# Altium schematic sheet LCD-Connecteur.SchDoc: LCD - Connecteurs
size Letter; ApprovedBy: APPROUVÉ PAR; Organization: Cegep Limoilou; Address1: 1300, 8e Avenue; Address2: Québec, QC; Address3: Canada; Address4: G1J 5L5; SheetNumber: 5; SheetTotal: 7
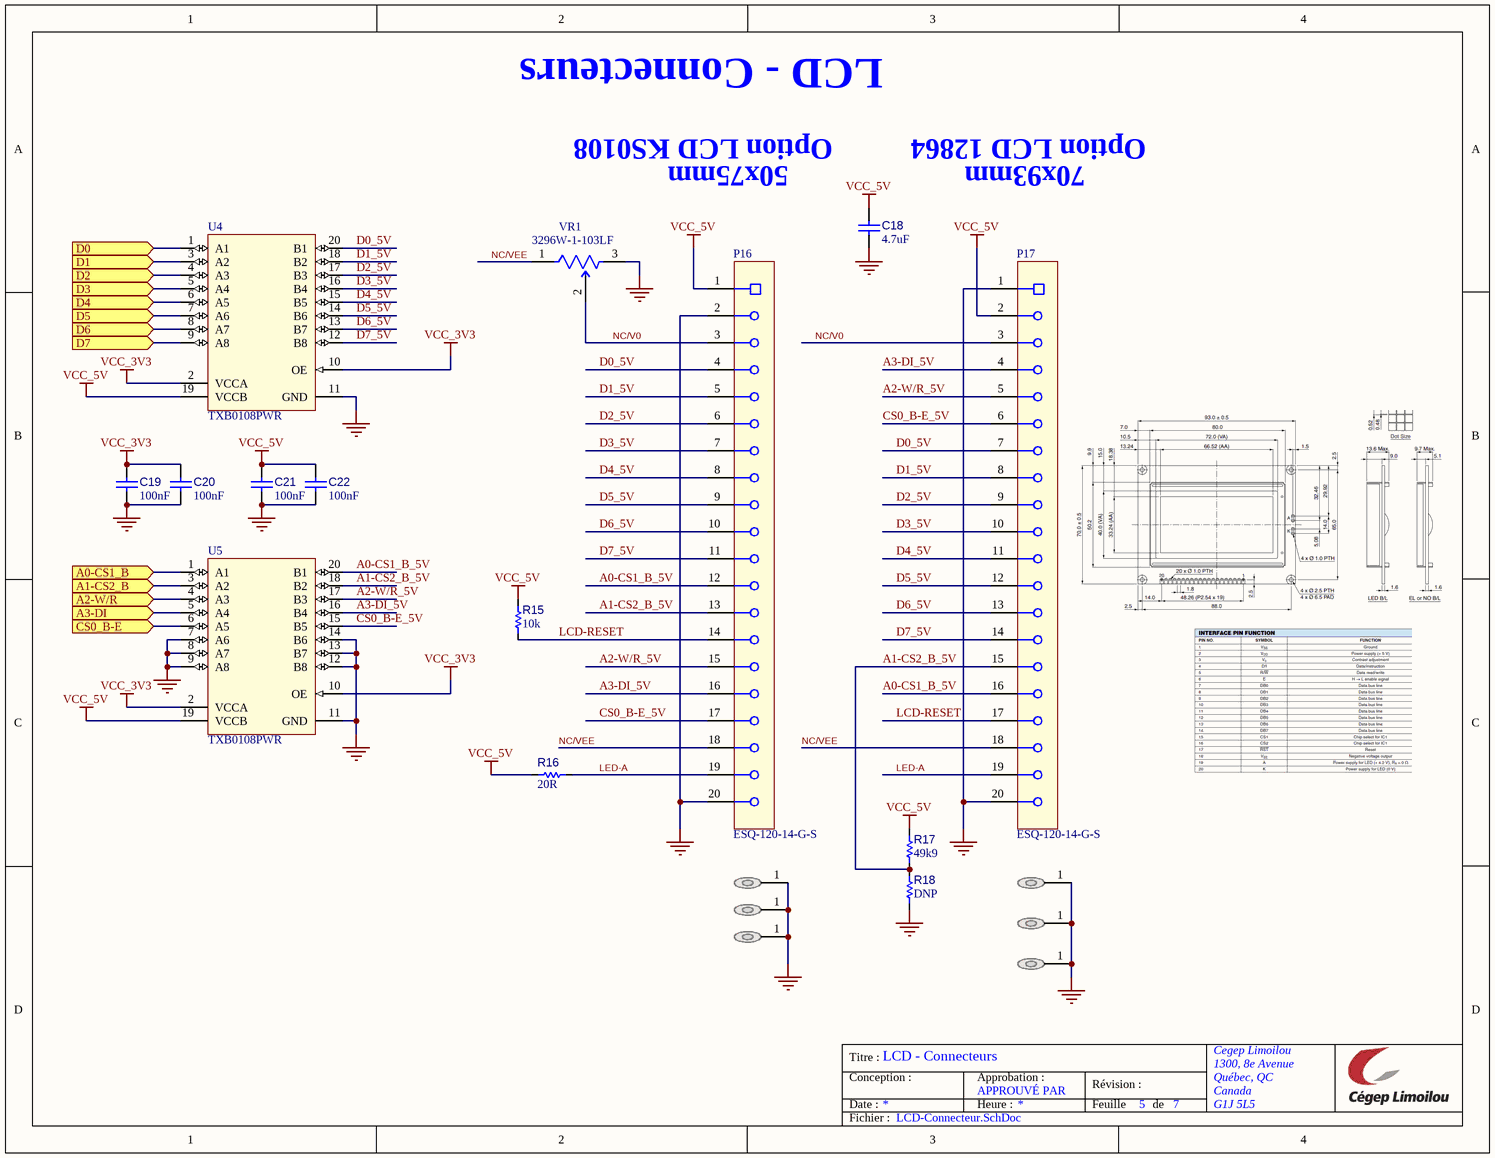
[diagram p0: LCD-Connecteur.SchDoc]

## Parts
C18  value 4.7uF  [C_2012[0805]]  (hidden comment: Cap 4.7uF 0805)
C19  value 100nF  [C_1005[0402]]  (hidden comment: Cap 100nF 0402)
C20  value 100nF  [C_1005[0402]]  (hidden comment: Cap 100nF 0402)
C21  value 100nF  [C_1005[0402]]  (hidden comment: Cap 100nF 0402)
C22  value 100nF  [C_1005[0402]]  (hidden comment: Cap 100nF 0402)
MH6  DNP  [MP_M-Hole_M2.5x0.45mm_LOOSE-FIT]  (value not drawn)  (no BOM)
MH7  DNP  [MP_M-Hole_M2.5x0.45mm_LOOSE-FIT]  (value not drawn)  (no BOM)
MH8  DNP  [MP_M-Hole_M2.5x0.45mm_LOOSE-FIT]  (value not drawn)  (no BOM)
MH9  DNP  [MP_M-Hole_M2.5x0.45mm_LOOSE-FIT]  (value not drawn)  (no BOM)
MH10  DNP  [MP_M-Hole_M2.5x0.45mm_LOOSE-FIT]  (value not drawn)  (no BOM)
MH11  DNP  [MP_M-Hole_M2.5x0.45mm_LOOSE-FIT]  (value not drawn)  (no BOM)
P16  ESQ-120-14-G-S  [CONN-SKT-20POS-100MIL]
P17  ESQ-120-14-G-S  [CONN-SKT-20POS-100MIL]
R15  value 10k  [R_1005[0402]]  (hidden comment: Res 10k 1% 0402)
R16  value 20R  [R_3216[1206]]  (hidden comment: Res 20R 1206)
R17  value 49k9  [R_1005[0402]]  (hidden comment: Res 49k9 1% 0402)
R18  value DNP  [R_1005[0402]]  (hidden comment: Res 49k9 1% 0402)  (no BOM)
U4  TXB0108PWR  [U_TSSOP65P660X450-20]
U5  TXB0108PWR  [U_TSSOP65P660X450-20]
VR1  3296W-1-103LF  [R-POT-TH-TOP]

## Ports
A0-CS1_B (in, see PCB-Support-STM32F407[3D]), A1-CS2_B (in, see PCB-Support-STM32F407[3D]), A2-W/R (in, see PCB-Support-STM32F407[3D]), A3-DI (in, see PCB-Support-STM32F407[3D]), CS0_B-E (in, see PCB-Support-STM32F407[3D]), D0 (in, see PCB-Support-STM32F407[3D]), D1 (in, see PCB-Support-STM32F407[3D]), D2 (in, see PCB-Support-STM32F407[3D]), D3 (in, see PCB-Support-STM32F407[3D]), D4 (in, see PCB-Support-STM32F407[3D]), D5 (in, see PCB-Support-STM32F407[3D]), D6 (in, see PCB-Support-STM32F407[3D]), D7 (in, see PCB-Support-STM32F407[3D])

## Nets
GND: C18.1 C19.1 C20.1 C21.1 C22.1 MH6.1 MH7.1 MH8.1 MH9.1 MH10.1 MH11.1 P16.2 P16.20 P17.1 P17.20 R18.1 U4.11(GND) U5.7(A6) U5.8(A7) U5.9(A8) U5.11(GND) U5.12(B8) U5.13(B7) U5.14(B6) VR1.3(CW)
VCC_3V3: C19.2 C20.2 U4.2(VCCA) U4.10(OE) U5.2(VCCA) U5.10(OE)
VCC_5V: C18.2 C21.2 C22.2 P16.1 P17.2 R15.2 R16.1 R17.2 U4.19(VCCB) U5.19(VCCB)
A0-CS1_B: U5.1(A1) ; port A0-CS1_B
A0-CS1_B_5V: P16.12 P17.16 U5.20(B1)
A1-CS2_B: U5.3(A2) ; port A1-CS2_B
A1-CS2_B_5V: P16.13 P17.15 R17.1 R18.2 U5.18(B2)
A2-W/R: U5.4(A3) ; port A2-W/R
A2-W/R_5V: P16.15 P17.5 U5.17(B3)
A3-DI: U5.5(A4) ; port A3-DI
A3-DI_5V: P16.16 P17.4 U5.16(B4)
CS0_B-E: U5.6(A5) ; port CS0_B-E
CS0_B-E_5V: P16.17 P17.6 U5.15(B5)
D0: U4.1(A1) ; port D0
D0_5V: P16.4 P17.7 U4.20(B1)
D1: U4.3(A2) ; port D1
D1_5V: P16.5 P17.8 U4.18(B2)
D2: U4.4(A3) ; port D2
D2_5V: P16.6 P17.9 U4.17(B3)
D3: U4.5(A4) ; port D3
D3_5V: P16.7 P17.10 U4.16(B4)
D4: U4.6(A5) ; port D4
D4_5V: P16.8 P17.11 U4.15(B5)
D5: U4.7(A6) ; port D5
D5_5V: P16.9 P17.12 U4.14(B6)
D6: U4.8(A7) ; port D6
D6_5V: P16.10 P17.13 U4.13(B7)
D7: U4.9(A8) ; port D7
D7_5V: P16.11 P17.14 U4.12(B8)
LCD-RESET: P16.14 P17.17 R15.1
LED-A: P16.19 P17.19 R16.2
NC/V0: P16.3 P17.3 VR1.2(WIPER)
NC/VEE: P16.18 P17.18 VR1.1(CCW)

## Notes on the sheet
- Option LCD KS0108
- Option LCD 12864
- 50x75mm
- 70x93mm
- Titre :
- Conception :
- Date :
- Approbation :
- Heure :
- Révision :
- Feuille
- de
- Fichier :

## Library data of the parts
C18 = CAP003: Capacitor type 1; Manufacturer 1: Taiyo Yuden; Manufacturer Part Number 1: TMK212AB7475KG-T; LibRef: CAP003; CEGEP: KCOND02SM; Tolerance: 10%; Rated Voltage: 25V; Dielectric: X7R; Supplier 1: LCSC; Supplier Part Number 1: C163186; Mounting Technology: SMT
C19-C22 = CAP001: Capacitor type 1; Manufacturer 1: Taiyo Yuden; Manufacturer Part Number 1: UMK105B7104KV-FR; LibRef: CAP001; CEGEP: KCOND01SM; Tolerance: 10%; Rated Voltage: 50V; Dielectric: X7R; Mounting Technology: SMT; Supplier 1: LCSC; Supplier Part Number 1: C2167491
MH6-MH11 = MH-2.5MM: Mounting Hole 2.5mm w/ Flat Washer; Manufacturer Part Number 1: DNP; Value: DNP; Supplier Part Number 1: N/A
P16 P17 = CONN-100MIL-SKT-01X20: CONN SOCKET 20POS 2.54MM; Manufacturer 1: Megastar; Manufacturer Part Number 1: ZX-PM2.54-1-20PY; Code CEGEP: KCONDIV0053; Localisation: R13-B035; Mounting Technology: TH; Supplier 1: LCSC; Supplier Part Number 1: C7499336
R15 = RES003: Resistor type 1; Manufacturer 1: Vishay; Manufacturer Part Number 1: CR0402F1002T1LF; LibRef: RES003; Puissance: 1/16W; Max Working Voltage: 50V; Tolerance: 1%; Mounting Technology: SMT; Supplier 1: Digikey; Supplier Part Number 1: 541-10.0KLCT-ND
R16 = RES020: Resistor type 1; Manufacturer 1: Yageo; Manufacturer Part Number 1: RC1206FR-0720RL; LibRef: RES020; CEGEP: RESI00020SMT; Tolerance: 1%; Puissance: 1/4W; Max Working Voltage: 200V; Mounting Technology: SMT; Supplier 1: LCSC; Supplier Part Number 1: C114941
R17 R18 = RES026: Resistor type 1; Manufacturer 1: Yageo; Manufacturer Part Number 1: RC0402FR-0749k9L; LibRef: RES026; Puissance: 1/16W; Max Working Voltage: 50V; Tolerance: 1%; Mounting Technology: SMT; Supplier 1: LCSC; Supplier Part Number 1: C137969
U4 U5 = U_TXB0108PWR: IC 8-Bit Bidirectional Voltage-Level Translator with Auto-Direction Sensing 20-Pin TSSOP (PW); Manufacturer 1: Texas Instruments; Mounting Technology: SMT; Manufacturer Part Number 1: TXB0108PWR; Supplier 1: LCSC; Supplier Part Number 1: C53406
VR1 = RP-POT10K-MULTI-TURN-TOP-TH: TRIMMER 10K OHM 0.5W PC PIN TOP; Manufacturer 1: JIERR; Manufacturer Part Number 1: 3296W-1-103LF; Mounting Technology: TH; Manufacturer 2: BOURNS; Manufacturer Part Number 2: 3296W-1-103LF; Supplier 1: LCSC; Supplier 2: LCSC; Supplier Part Number 1: C49190453; Supplier Part Number 2: C34846